# Altium schematic sheet FMC_top.SchDoc: FMC Connector Top
size A; Author: James Thomas; CompanyName: BYUI; DrawnBy: James Thomas; Engineer: James Thomas; Organization: CSEE; DocumentNumber: 8; Revision: 0.0.1; SheetNumber: 8; SheetTotal: 15
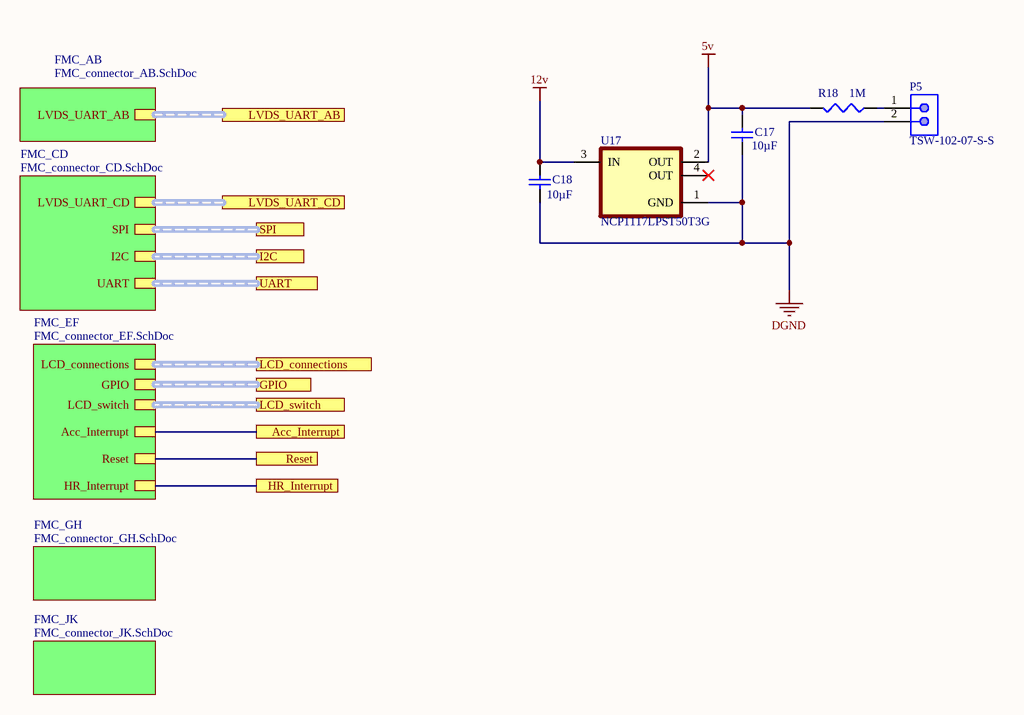
[diagram p0: FMC_top.SchDoc]

## Parts
C17  Capacitance: 10µF  [CAPC1608X90X20LL10]  (hidden comment: C1608X5R1A106K080AC)
C18  Capacitance: 10µF  [CAPC1608X90X20LL10]  (hidden comment: C1608X5R1A106K080AC)
P5  TSW-102-07-S-S  [SMTC-TSW-102-07-S-S]
R18  value 1M  [J1-0603]  (hidden comment: Res3)
U17  NCP1117LPST50T3G  [SOT230P700X180-4N]

## Sub-sheets
FMC_AB = FMC_connector_AB.SchDoc: LVDS_UART_AB (harness LVDS_UART_AB)
FMC_CD = FMC_connector_CD.SchDoc: LVDS_UART_CD (harness LVDS_UART_CD), I2C (harness I2C), SPI (harness SPI), UART (harness UART)
FMC_EF = FMC_connector_EF.SchDoc: LCD_connections (harness LCD_connections), GPIO (harness GPIO), LCD_switch (harness LCD_switch), Acc_Interrupt, Reset, HR_Interrupt
FMC_GH = FMC_connector_GH.SchDoc: no entries
FMC_JK = FMC_connector_JK.SchDoc: no entries

## Ports
Acc_Interrupt, GPIO (harness GPIO), HR_Interrupt, I2C (harness I2C), LCD_connections (harness LCD_connections), LCD_switch (harness LCD_switch), LVDS_UART_AB, LVDS_UART_CD, Reset, SPI (harness SPI), UART (harness UART)

## Nets
5v: C17.2 R18.2 U17.2(OUT)
12v: C18.2 U17.3(IN)
DGND: C17.1 C18.1 P5.2 U17.1(GND)
Acc_Interrupt: port Acc_Interrupt, sheet FMC_EF/Acc_Interrupt
HR_Interrupt: port HR_Interrupt, sheet FMC_EF/HR_Interrupt
Reset: port Reset, sheet FMC_EF/Reset
NetP5_1: P5.1 R18.1

Not connected (* = marked no-connect by the designer): U17 4(OUT)*

## Buses and harness runs
harness port GPIO = sheet FMC_EF/GPIO
harness port I2C = sheet FMC_CD/I2C
harness port LCD_connections = sheet FMC_EF/LCD_connections
harness port LCD_switch = sheet FMC_EF/LCD_switch
harness port LVDS_UART_AB = sheet FMC_AB/LVDS_UART_AB
harness port LVDS_UART_CD = sheet FMC_CD/LVDS_UART_CD
harness port SPI = sheet FMC_CD/SPI
harness port UART = sheet FMC_CD/UART

## Library data of the parts
C17 C18 = CMP-2000-04979-1: Chip Capacitor, 10 uF, +/- 10%, 10 V, -55 to 85 degC, 0603 (1608 Metric), RoHS, Tape and Reel; PCN Part Number: MLCCPartNumberChange30/Nov/2012; Manufacturer: TDK; Temperature Coefficient: X5R; Product Training Modules: CSeriesGeneralApplicationsSEAT,CCV,andTVCLDesignToolsGuidetoReplacinganElectrolyticCapacitorwithanMLCC; Online Catalog: CSeries,GeneralPurpose; Voltage - Rated: 10V; Other Names: 445-7486-1; Design Resources: 20WNon-IsolatedBuckLEDDriverUsingPLLNK460KG; Kits: 445-9003-KIT-ND-KITCAPCERHICAPMLCCSMD; Height - Seated (Max): -; Family: CeramicCapacitors; Package Description: 2-Pin Surface Mount Device, Body 1.6 x 0.8 mm; Category: Capacitors; Datasheet Version: Mar-15; RoHS Information: RoHSCertificate-MLCC; Thickness (Max): 0.035"(0.90mm); Operating Temperature: -55degC~85degC; Package Reference: 603; Series: C; Applications: GeneralPurpose; Datasheet URL: http://download.siliconexpert.com/pdfs/2015/4/21/15/54/45/779/tdk_/manual/37024850441143360mlcc_commercial_general_en.pdf; Features: -; Lead Style: -; Lead Spacing: -; Ratings: -; Size / Dimension: 0.063"Lx0.031"W(1.60mmx0.80mm); Tolerance: ±10%; Mounting Type: SurfaceMount,MLCC; Standard Package: 1; Package / Case: 0603(1608Metric); Manufacturer URL: http://www.tdk.com/; Packaging: CutTape(CT); Manufacturer Part Number: C1608X5R1A106K080AC
P5 = CMP-1681-00004-4: Male Header, Pitch 2.54 mm, 1 x 2 Position, Height 8.38 mm, Tail Length 2.54 mm, -55 to 125 degC, RoHS, Bulk; Manufacturer: Samtec; Rows: 1; ComponentLink1URL: http://www.samtec.com/; Contact Finish: Gold; Mounting Technology: Through Hole; PackageReference: TSW-102-07-S-S; RoHSCompliant: true; Pins: 2; Contact Material: Bronze; ComponentLink2Description: Datasheet; Max Operating Temperature: 125 degC; Min Operating Temperature: -55 degC; Height: 8.38 mm; Packaging: Bulk; ComponentLink1Description: Manufacturer URL; PackageDescription: Male Header, Pitch 2.54 mm, 1 x 2 Position, Height 8.38 mm, Tail Length 2.54 mm; Colour: Black; Contact Plating: Gold; Length: 5.08 mm; ComponentLink2URL: http://suddendocs.samtec.com/catalog_english/tsw_th.pdf; DatasheetVersion: 12/2015; Mount: Through Hole; Lead Pitch: 0.1 inch; REACH SVHC: No SVHC; Package Quantity: 1
R18 = Res3: Resistor; Published: 8-Jun-2000; LatestRevisionDate: 29-May-2009; LatestRevisionNote: IPC-7351 Footprint Added.; PackageReference: J1-0603; Publisher: Altium Limited; PackageDescription: Chip Resistor
U17 = NCP1117LPST50T3G: Linear Voltage Regulator IC 1 Output 1A SOT-223; MF: ON Semiconductor; Digi-Key_Purchase_URL: https://www.digikey.com/product-detail/en/on-semiconductor/NCP1117LPST50T3G/NCP1117LPST50T3GOSCT-ND/5801728?utm_source=snapeda&utm_medium=aggregator&utm_campaign=symbol; MP: NCP1117LPST50T3G; Package: SOT-223 ON Semiconductor; SnapEDA_Link: https://www.snapeda.com/parts/NCP1117LPST50T3G/ON%20Semiconductor/view-part/451805/?ref=snap; Value: *; Digi-Key_Part_Number: NCP1117LPST50T3GOSCT-ND